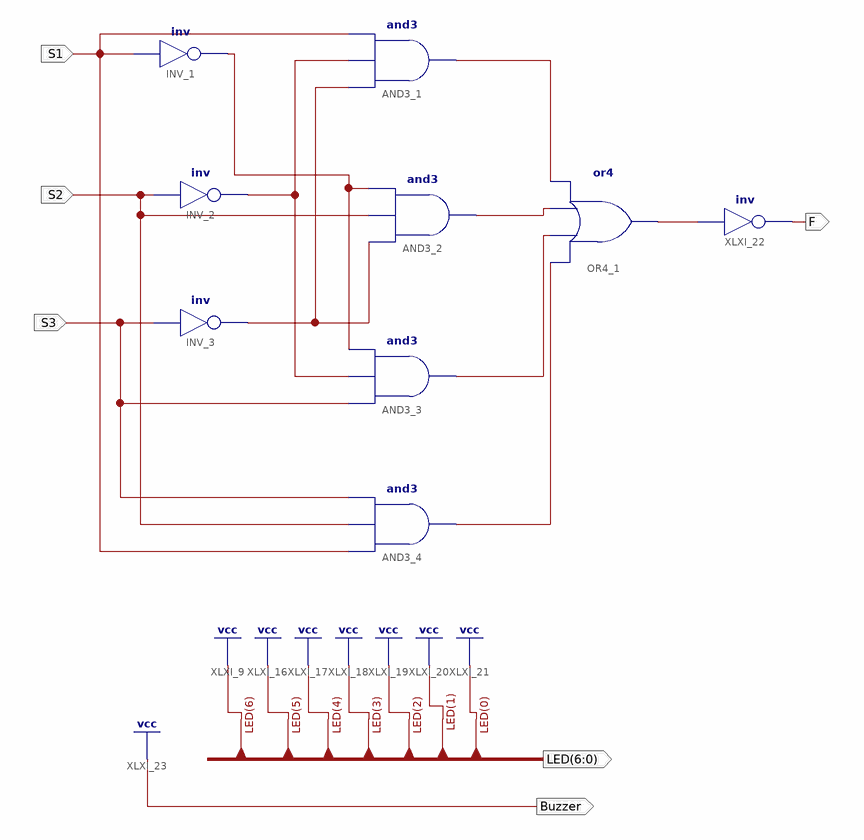
[diagram p0: schematic sheet 1]
// Xilinx ISE schematic LampCtrl.sch (kintex7) as structural Verilog: 9 symbols, 6 ports
module LampCtrl (
  input  S1,
  input  S3,
  input  S2,
  output [6:0] LED,
  output Buzzer,
  output F
);

  wire A, B, C, D, NS1, NS2, NS3, XLXN_46;

  not INV_1 (NS1, S1);
  not INV_2 (NS2, S2);
  not INV_3 (NS3, S3);
  and AND3_2 (B, NS3, S2, NS1);
  and AND3_3 (C, S3, NS2, NS1);
  and AND3_4 (D, S1, S2, S3);
  and AND3_1 (A, NS3, NS2, S1);
  or OR4_1 (XLXN_46, D, C, B, A);
  not XLXI_22 (F, XLXN_46);

  assign Buzzer = 1'b1;
  assign LED = {7{1'b1}};
endmodule
